# EasyEDA schematic DCC-Base-Station-Experimental-Platform.json
TITLE: DCC Base Station - V2; REV: 1.0; Date: 2021-02-03; Sheet: 1/1; Drawn By: helmut-f; Company: Your Company
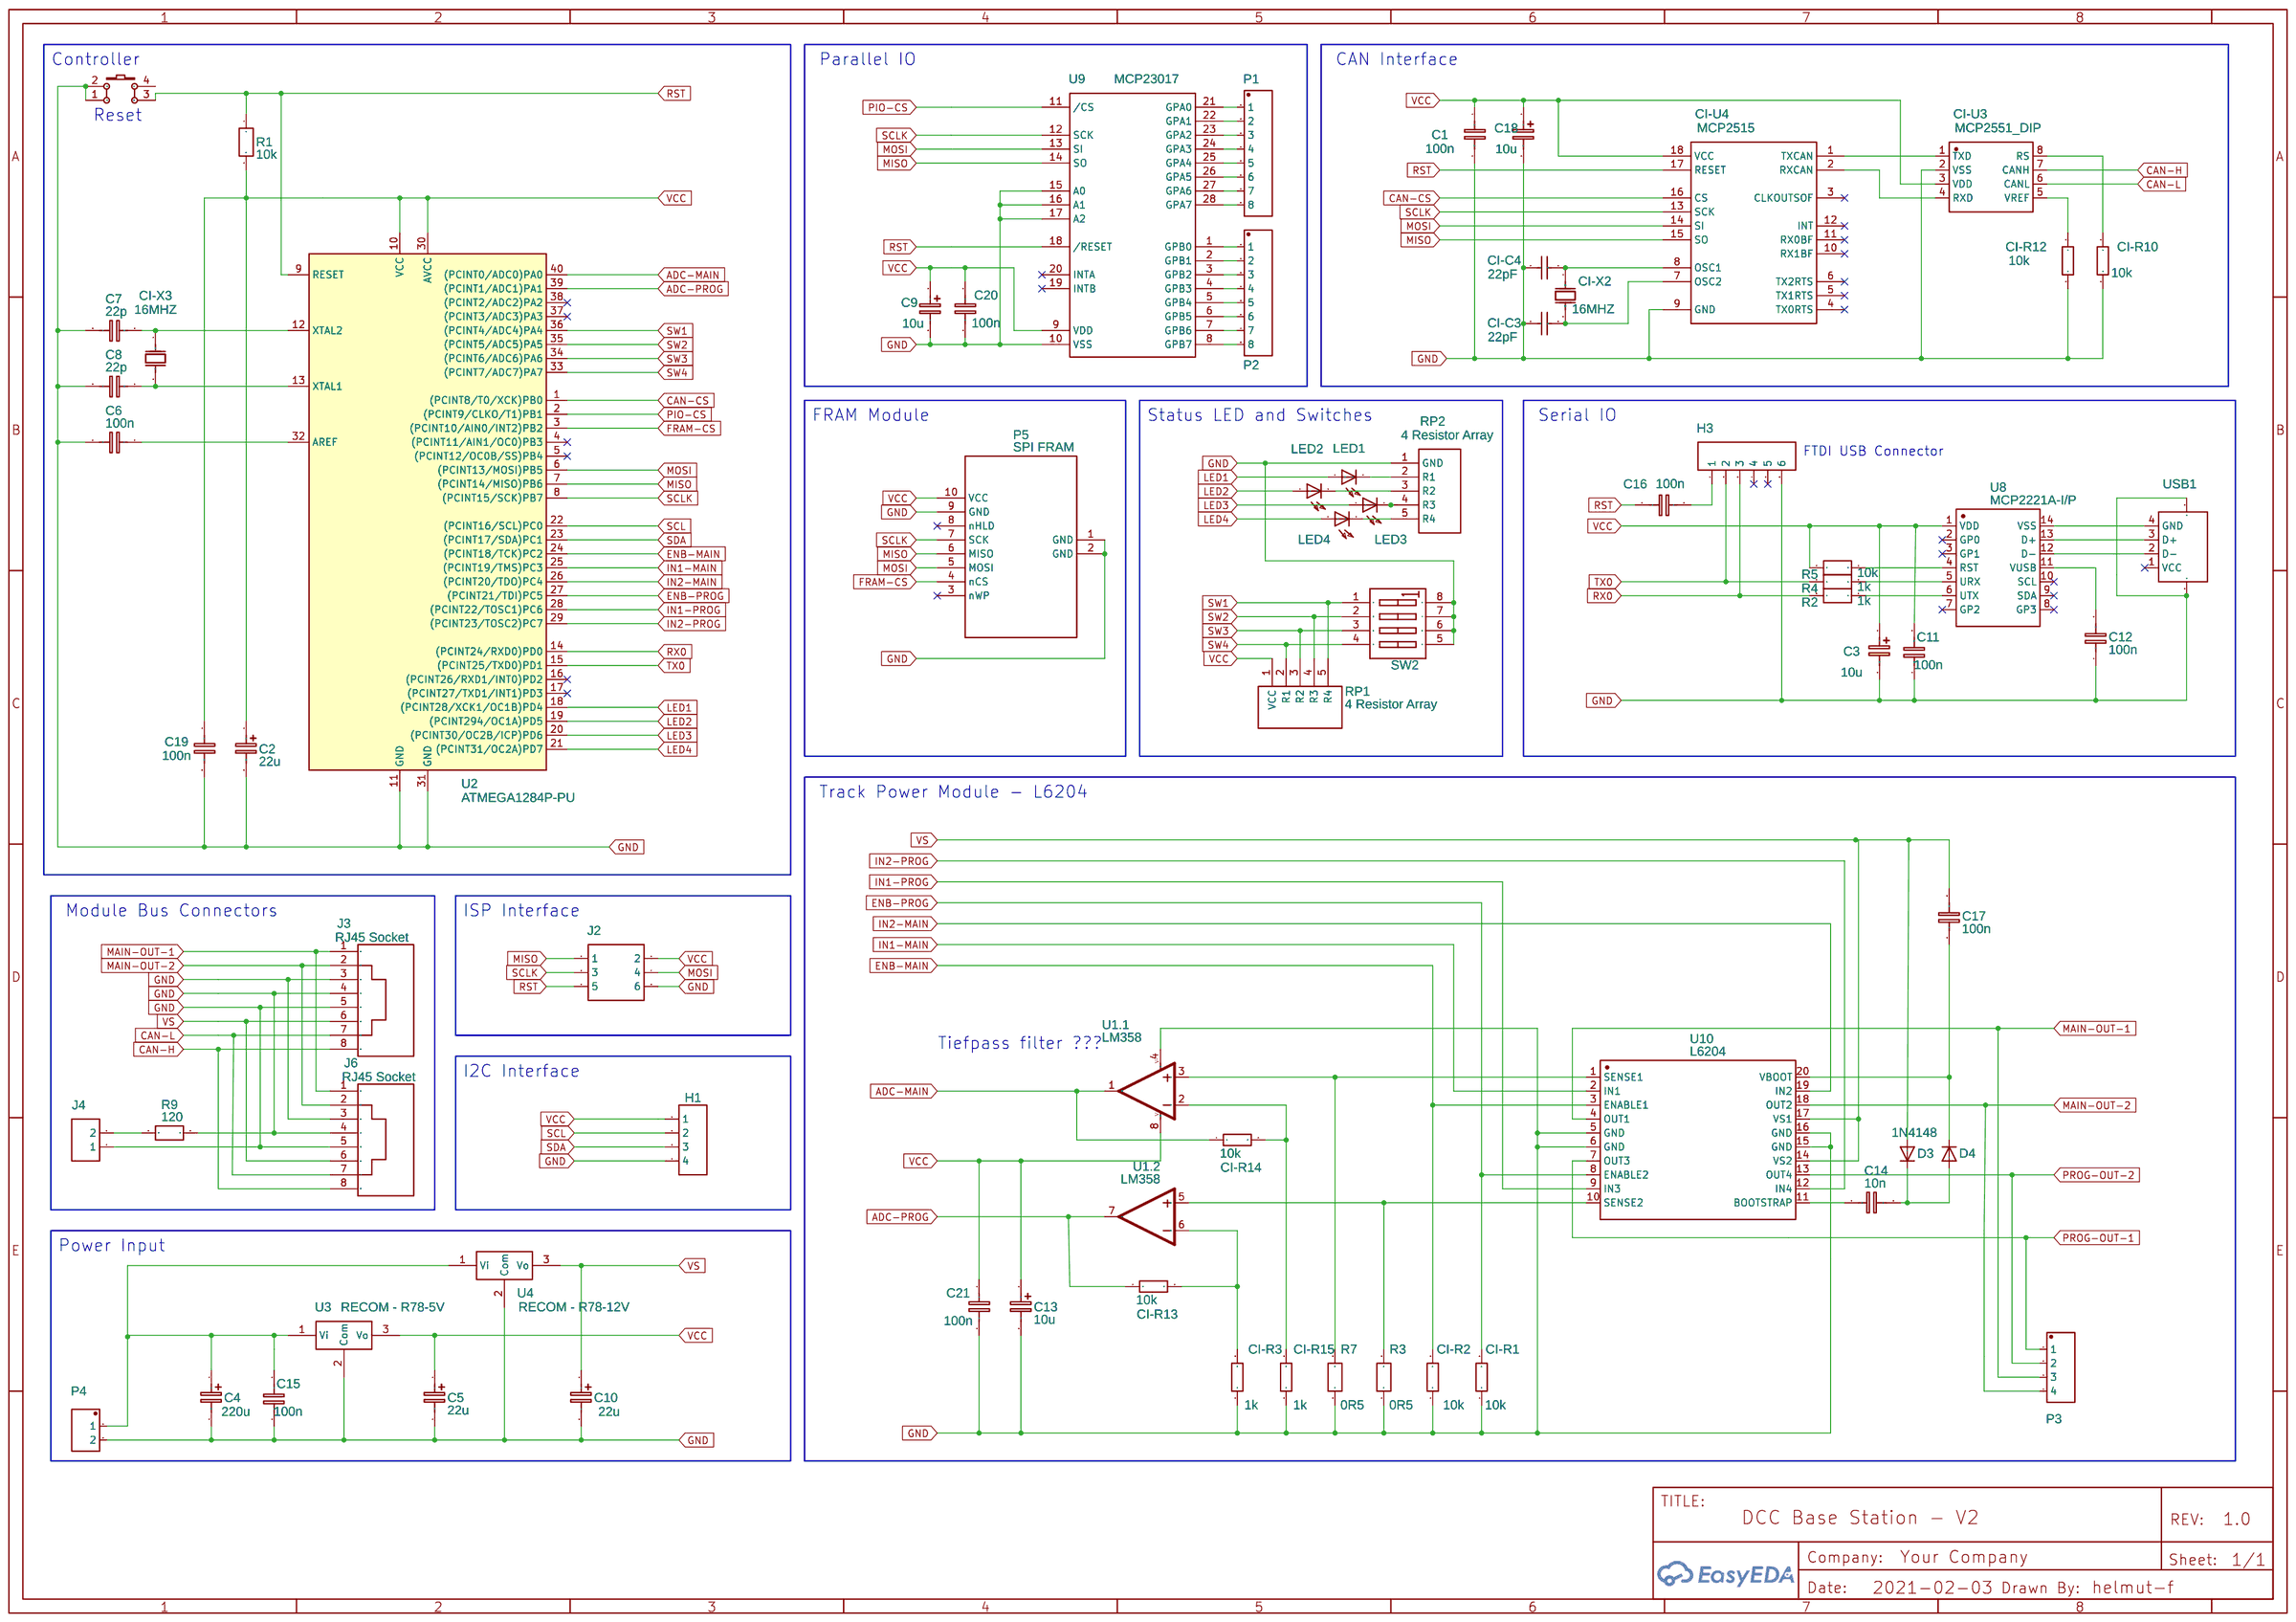
[diagram p0: schematic sheet]

## Parts
C1  100n  [RAD-0.2]
C2  22u  [CAP-D4.0×F1.5]
C3  10u  [CAP-D4.0×F1.5]
C4  220u  [CAP-D4.0×F1.5]
C5  22u  [CAP-D4.0×F1.5]
C6  100n  [RAD-0.2]
C7  22p  [RAD-0.2]
C8  22p  [RAD-0.2]
C9  10u  [CAP-D4.0×F1.5]
C10  22u  [CAP-D4.0×F1.5]
C11  100n  [RAD-0.2]
C12  100n  [RAD-0.2]
C13  10u  [CAP-D4.0×F1.5]
C14  10n  [RAD-0.2]
C15  100n  [RAD-0.2]
C16  100n  [RAD-0.2]
C17  100n  [RAD-0.2]
C18  10u  [CAP-D4.0×F1.5]
C19  100n  [RAD-0.2]
C20  100n  [RAD-0.2]
C21  100n  [RAD-0.2]
CI-C3  22pF  [RAD-0.2]
CI-C4  22pF  [RAD-0.2]
CI-R1  10k  [AXIAL-0.1]
CI-R2  10k  [AXIAL-0.1]
CI-R3  1k  [AXIAL-0.1]
CI-R10  10k  [AXIAL-0.1]
CI-R12  10k  [AXIAL-0.1]
CI-R13  10k  [AXIAL-0.1]
CI-R14  10k  [AXIAL-0.1]
CI-R15  1k  [AXIAL-0.1]
CI-U3  MCP2551_DIP  [MCP2551_DIP]
CI-U4  MCP2515  [18-DIP]
CI-X2  16MHZ  [OSC-49S-1]
CI-X3  16MHZ  [OSC-49S-1]
D3  1N4148  [DO35-10]
D4  1N4148DO35-10  [DO35-10]
H1  HDR-F-2.54_1x4  [HDR-F-2.54_1X4]
H3  HDR-F-2.54_1x6  [HDR-F-2.54_1X6]
J2  HDR-M-2.54-2X3P  [HDR-M-2.54_2X3]
J3  RJ45 Socket  [54602-908LF_1]
J4  HDR-M-2.54_1x2  [HDR-M-2.54_1X2]
J6  RJ45 Socket  [54602-908LF_1]
KEY2  K4-6×6_TH  [KEY-TH_4P-L6.0-W6.0-P4.50-LS6.5]
LED1  LED_2MM_FLAT_TOP  [KINGBRIGHT_2MM]
LED2  LED_2MM_FLAT_TOP  [KINGBRIGHT_2MM]
LED3  LED_2MM_FLAT_TOP  [KINGBRIGHT_2MM]
LED4  LED_2MM_FLAT_TOP  [KINGBRIGHT_2MM]
P1  Terminal_block_8P_2.54  [TERMINAL_BLOCK_0.5/8-2.54MM]
P2  Terminal_block_8P_2.54  [TERMINAL_BLOCK_0.5/8-2.54MM]
P3  Terminal_block_4P_2.54  [TERMINAL_BLOCK_0.5/4-2.54MM]
P4  Terminal_block_2P_2.54  [TERMINAL_BLOCK_0.5/2-2.54MM]
P5  SPI FRAM  [SPI FRAM]
R1  10k  [R_AXIAL-0.3]
R2  1k  [R_AXIAL-0.3]
R3  0R5  [R_AXIAL-0.5]
R4  1k  [R_AXIAL-0.3]
R5  10k  [R_AXIAL-0.3]
R7  0R5  [R_AXIAL-0.5]
R9  120  [R_AXIAL-0.3]
RP1  4 Resistor Array  [4 RESISTOR ARRAY]
RP2  4 Resistor Array  [4 RESISTOR ARRAY]
SW2  4 X DIP_switch  [DSWB04LHGET]
U1  LM358  [DIP08-KIT]  (sections 1,2)
U2  ATMEGA1284P-PU  [DIL40]
U3  RECOM - R78-5V  [DCDC-CONV_RECOM_R-78HBXX-0.5]
U4  RECOM - R78-12V  [DCDC-CONV_RECOM_R-78HBXX-0.5]
U8  MCP2221A-I/P  [DIP14]
U9  MCP23017  [DIP-28_300MIL]
U10  L6204  [DIP20]
USB1  USB-Type A_Male  [USB-A-TH_48037-0001]

## Library data of the parts
C1 C6-C8 C16 C17 C19-C21 = C_0603_EU: Contributor: LCEDA_Lib; Package Display: No
C2-C5 C9 C10 C13 C18 = CE_TH_D4.0×F1.5_EU: Contributor: LCEDA_Lib
C11 C12 C15 = C_0603_EU: Contributor: LCEDA_Lib
C14 = C_RAD-0.2_EU: Contributor: LCEDA_Lib
CI-C3 = 22pf/50V 10%: Supplier: LCSC; Manufacturer: ReliaPro; Supplier Part: C9316
CI-C4 = 22pf/50V 10%: Supplier: LCSC; Manufacturer: ReliaPro; Supplier Part: C9316; Package Display: No
CI-R1-CI-R3 CI-R10 CI-R12-CI-R15 = RESISTOR-AXIAL-0.1
CI-U3 = MCP2551_DIP: Manufacturer: Microchip; Manufacturer Part: MCP2551; Contributor: Ashutosh Parmar
CI-U4 = MCP2515: Microchip CAN Controller with SPI Interface; Manufacturer: Microchip; Contributor: samvanbrussel
CI-X2 CI-X3 = 16MHZ: EasyEDA: C16212; Supplier Part: C16212; Supplier: EasyEDA; Manufacturer: EasyEDA; Manufacturer Part: X49SD16MSD2SC
D3 D4 = 1N4148DO35-10: DIODE; Package Display: No
H1 = HDR-F-2.54_1x4: Supplier Part: C225501; Supplier: LCSC; Contributor: LCEDA_Lib
H3 = HDR-F-2.54_1x6: Supplier Part: C40877; Supplier: LCSC; Contributor: LCEDA_Lib
J2 = HDR-IDC-2.54-2X3P: Supplier: LCSC; Manufacturer: BOOMELE; Manufacturer Part: 2X3 2.54mm IDC Box; image: //image.lceda.cn/szlcsc/C11214.jpg; Supplier Part: C11214; Package Display: No
J3 J6 = RJ45 Socket: Contributor: dwfriend; Supplier: Mouser; Supplier Part: 649-54602-908LF; Manufacturer: Amphenol FCI
J4 = HDR-M-2.54_1x2: Supplier Part: C124375; Supplier: LCSC; Contributor: LCEDA_Lib
KEY2 = K4-6×6_TH: Supplier: LCSC; Supplier Part: C136684; Manufacturer: 韩国韩荣; Manufacturer Part: K2-1102DP-E4SW-04; Contributor: LCEDA_Lib
LED1-LED4 = LED_2MM_FLAT_TOP: Contributor: olafl
P1 P2 = Terminal_block_8P_2.54: Manufacturer: Phoenix Contact; Manufacturer Part: MTP0.5/4-2.54; Supplier: Element14; Supplier Part: 3041414; link: https://www.phoenixcontact.com/online/portal/us?uri=pxc-oc-itemdetail:pid=1725672&library=usen&tab=1; Contributor: sbpk
P3 = Terminal_block_4P_2.54: Manufacturer: Phoenix Contact; Manufacturer Part: MTP0.5/4-2.54; Supplier: Element14; Supplier Part: 3041414; link: https://www.phoenixcontact.com/online/portal/us?uri=pxc-oc-itemdetail:pid=1725672&library=usen&tab=1; Contributor: sbpk
P4 = Terminal_block_2P_2.54: Manufacturer: Phoenix Contact; Manufacturer Part: MTP0.5/4-2.54; Supplier: Element14; Supplier Part: 3041414; link: https://www.phoenixcontact.com/online/portal/us?uri=pxc-oc-itemdetail:pid=1725672&library=usen&tab=1; Contributor: sbpk
P5 = SPI FRAM: sourceId: 1T5FDZYC8
R1 R2 R4 R5 R9 = R_AXIAL-0.3_EU: Contributor: LCEDA_Lib
R3 R7 = R_AXIAL-0.5_EU: Contributor: LCEDA_Lib
RP1 = 4 Resistor Array: Manufacturer Part: Array_resistor_8; Contributor: hdutton; link: none
RP2 = 4 Resistor Array: Manufacturer Part: Array_resistor_8; Contributor: hdutton; link: none; Package Display: No
SW2 = 4 X DIP_switch: Supplier Part: C99418; Supplier: LCSC; Manufacturer: KE; Manufacturer Part: DIP switch,Dip Switch,DSWB04LHGET; Contributor: TomGeorge
U1 = LM358: Contributor: SparkFun; subpart_no: 1
U2 = ATMEGA1284P-PU: Contributor: markusbudke
U3 U4 = RECOM: Manufacturer Part: R-78B3.3-2.0; Contributor: eddy.rolland; Supplier Part: 945-3040-ND; Supplier: Digi-Key; Manufacturer: Recom Power; Price for 1: 8,49000; Price for 10: 8,35600; Price for 25: 8,22640; Price for 100: 7,19820; Weight (in g): 4
U8 = MCP2221A-I/P
U9 = MCP23017: Supplier: LCSC; Manufacturer: MICROCHIP; Manufacturer Part: MCP23S17-E/SP; Contributor: LCSC; Supplier Part: C148096
U10 = L6204
USB1 = USB-Type A_Male: Supplier Part: C112454; Supplier: LCSC; Manufacturer: SOFNG; Manufacturer Part: USB-05; Contributor: LCEDA_Lib

## Nets
GND: C1.2 C2.2 C3.2 C4.2 C5.2 C6.2 C7.2 C8.2 C9.2 C10.2 C11.1 C12.1 C13.2 C15.1 C18.2 C19.2 C20.2 C21.2 CI-C3.1 CI-C4.1 CI-R1.1 CI-R2.1 CI-R3.1 CI-R10.2 CI-R12.2 CI-R15.1 CI-U3.2(VSS) CI-U4.9(GND) H1.4 H3.6 J2.6 J3.3 J3.4 J3.5 J4.1 J6.3 J6.4 J6.5 KEY2.1 KEY2.2 P4.2 P5.1(GND) P5.2(GND) P5.9(GND) R3.1 R7.1 R9.1 RP2.1(GND) SW2.5 SW2.6 SW2.7 SW2.8 U1.4(V-) U2.11(GND) U2.31(GND) U3.2(Com) U4.2(Com) U9.10(VSS) U9.15(A0) U9.16(A1) U9.17(A2) U10.5(GND) U10.6(GND) U10.15(GND) U10.16(GND) USB1.5 USB1.6
VCC: C1.1 C2.1 C3.1 C5.1 C9.1 C11.2 C13.1 C18.1 C19.1 C20.1 C21.1 CI-U3.3(VDD) CI-U4.18(VCC) H1.1 J2.2 P5.10(VCC) R1.2 R5.2 RP1.1(VCC) U1.8(V+) U2.10(VCC) U2.30(AVCC) U3.3(Vo) U8.1(VDD) U9.9(VDD)
ADC-MAIN: CI-R14.1 U1.1(OUT) U2.40((PCINT0/ADC0)PA0)
ADC-PROG: CI-R13.1 U1.7(OUT) U2.39((PCINT1/ADC1)PA1)
CAN-CS: CI-U4.16(CS) U2.1((PCINT8/T0/XCK)PB0)
CAN-H: CI-U3.7(CANH) J3.8 J6.8
CAN-L: CI-U3.6(CANL) J3.7 J6.7
ENB-MAIN: CI-R2.2 U2.24((PCINT18/TCK)PC2) U10.3(ENABLE1)
ENB-PROG: CI-R1.2 U2.27((PCINT21/TDI)PC5) U10.8(ENABLE2)
FRAM-CS: P5.4(nCS) U2.3((PCINT10/AIN0/INT2)PB2)
IN1-MAIN: U2.25((PCINT19/TMS)PC3) U10.2(IN1)
IN1-PROG: U2.28((PCINT22/TOSC1)PC6) U10.9(IN3)
IN2-MAIN: U2.26((PCINT20/TDO)PC4) U10.19(IN2)
IN2-PROG: U2.29((PCINT23/TOSC2)PC7) U10.12(IN4)
LED1: LED1.A U2.18((PCINT28/XCK1/OC1B)PD4)
LED2: LED2.A U2.19((PCINT294/OC1A)PD5)
LED3: LED3.A U2.20((PCINT30/OC2B/ICP)PD6)
LED4: LED4.A U2.21((PCINT31/OC2A)PD7)
MAIN-OUT-1: J3.1 J6.1 P3.3 U10.4(OUT1)
MAIN-OUT-2: J3.2 J6.2 P3.4 U10.18(OUT2)
MISO: CI-U4.15(SO) J2.1 P5.6(MISO) U2.7((PCINT14/MISO)PB6) U9.14(SO)
MOSI: CI-U4.14(SI) J2.4 P5.5(MOSI) U2.6((PCINT13/MOSI)PB5) U9.13(SI)
PIO-CS: U2.2((PCINT9/CLKO/T1)PB1) U9.11(/CS)
PROG-OUT-1: P3.1 U10.7(OUT3)
PROG-OUT-2: P3.2 U10.13(OUT4)
RST: C16.2 CI-U4.17(RESET) J2.5 KEY2.3 R1.1 U2.9(RESET) U9.18(/RESET)
RX0: H3.3 R2.2 U2.14((PCINT24/RXD0)PD0)
SCL: H1.2 U2.22((PCINT16/SCL)PC0)
SCLK: CI-U4.13(SCK) J2.3 P5.7(SCK) U2.8((PCINT15/SCK)PB7) U9.12(SCK)
SDA: H1.3 U2.23((PCINT17/SDA)PC1)
SW1: RP1.5(R4) SW2.1(A1) U2.36((PCINT4/ADC4)PA4)
SW2: RP1.4(R3) SW2.2(A2) U2.35((PCINT5/ADC5)PA5)
SW3: RP1.3(R2) SW2.3(A3) U2.34((PCINT6/ADC6)PA6)
SW4: RP1.2(R1) SW2.4(A4) U2.33((PCINT7/ADC7)PA7)
TX0: H3.2 R4.2 U2.15((PCINT25/TXD0)PD1)
VS: C10.1 C17.2 D3.A J3.6 J6.6 U4.3(Vo) U10.14(VS2) U10.17(VS1)
Net-(C4-1): C4.1 C15.2 P4.1 U3.1(Vi) U4.1(Vi)
Net-(C6-1): C6.1 U2.32(AREF)
Net-(C7-1): C7.1 CI-X3.1(OSC1) U2.12(XTAL2)
Net-(C8-1): C8.1 CI-X3.2(OSC2) U2.13(XTAL1)
Net-(C12-2): C12.2 U8.11(VUSB)
Net-(C14-1): C14.1 U10.11(BOOTSTRAP)
Net-(C14-2): C14.2 D3.C D4.A
Net-(C16-1): C16.1 H3.1
Net-(C17-1): C17.1 D4.C U10.20(VBOOT)
Net-(CI-C3-2): CI-C3.2 CI-U4.7(OSC2) CI-X2.2(OSC2)
Net-(CI-C4-2): CI-C4.2 CI-U4.8(OSC1) CI-X2.1(OSC1)
Net-(CI-R3-2): CI-R3.2 CI-R13.2 U1.6(-IN)
Net-(CI-R10-1): CI-R10.1 CI-U3.8(RS)
Net-(CI-R12-1): CI-R12.1 CI-U3.5(VREF)
Net-(CI-R14-2): CI-R14.2 CI-R15.2 U1.2(-IN)
Net-(CI-U3-1): CI-U3.1(TXD) CI-U4.1(TXCAN)
Net-(CI-U3-4): CI-U3.4(RXD) CI-U4.2(RXCAN)
Net-(J4-2): J4.2 R9.2
Net-(LED1-K): LED1.K(C) RP2.2(R1)
Net-(LED2-K): LED2.K(C) RP2.3(R2)
Net-(LED3-K): LED3.K(C) RP2.4(R3)
Net-(LED4-K): LED4.K(C) RP2.5(R4)
Net-(P1-1): P1.1 U9.21(GPA0)
Net-(P1-2): P1.2 U9.22(GPA1)
Net-(P1-3): P1.3 U9.23(GPA2)
Net-(P1-4): P1.4 U9.24(GPA3)
Net-(P1-5): P1.5 U9.25(GPA4)
Net-(P1-6): P1.6 U9.26(GPA5)
Net-(P1-7): P1.7 U9.27(GPA6)
Net-(P1-8): P1.8 U9.28(GPA7)
Net-(P2-1): P2.1 U9.1(GPB0)
Net-(P2-2): P2.2 U9.2(GPB1)
Net-(P2-3): P2.3 U9.3(GPB2)
Net-(P2-4): P2.4 U9.4(GPB3)
Net-(P2-5): P2.5 U9.5(GPB4)
Net-(P2-6): P2.6 U9.6(GPB5)
Net-(P2-7): P2.7 U9.7(GPB6)
Net-(P2-8): P2.8 U9.8(GPB7)
Net-(R2-1): R2.1 U8.6(UTX)
Net-(R3-2): R3.2 U1.5(+IN) U10.10(SENSE2)
Net-(R4-1): R4.1 U8.5(URX)
Net-(R5-1): R5.1 U8.4(RST)
Net-(R7-2): R7.2 U1.3(+IN) U10.1(SENSE1)
Net-(U8-12): U8.12(D-) USB1.2(D-)
Net-(U8-13): U8.13(D+) USB1.3(D+)
Net-(U8-14): U8.14(VSS) USB1.4(GND)

Not connected (* = marked no-connect by the designer): CI-U4 3(CLKOUTSOF)* 4(TX0RTS)* 5(TX1RTS)* 6(TX2RTS)* 10(RX1BF)* 11(RX0BF)* 12(INT)*; H3 4* 5*; KEY2 4; P5 3(nWP)* 8(nHLD)*; U2 4((PCINT11/AIN1/OC0)PB3)* 5((PCINT12/OC0B/SS)PB4)* 16((PCINT26/RXD1/INT0)PD2)* 17((PCINT27/TXD1/INT1)PD3)* 37((PCINT3/ADC3)PA3)* 38((PCINT2/ADC2)PA2)*; U8 2(GP0)* 3(GP1)* 7(GP2)* 8(GP3)* 9(SDA)* 10(SCL)*; U9 19(INTB)* 20(INTA)*; USB1 1(VCC)*

## Notes on the sheet
- Controller
- Parallel IO
- CAN Interface
- Reset
- FRAM Module
- Status LED and Switches
- Serial IO
- FTDI USB Connector
- Track Power Module - L6204
- Module Bus Connectors
- ISP Interface
- Tiefpass filter ???
- I2C Interface
- Power Input
